# Altium schematic sheet Ubiwatch.SchDoc
size A; SheetNumber: 1; SheetTotal: 4
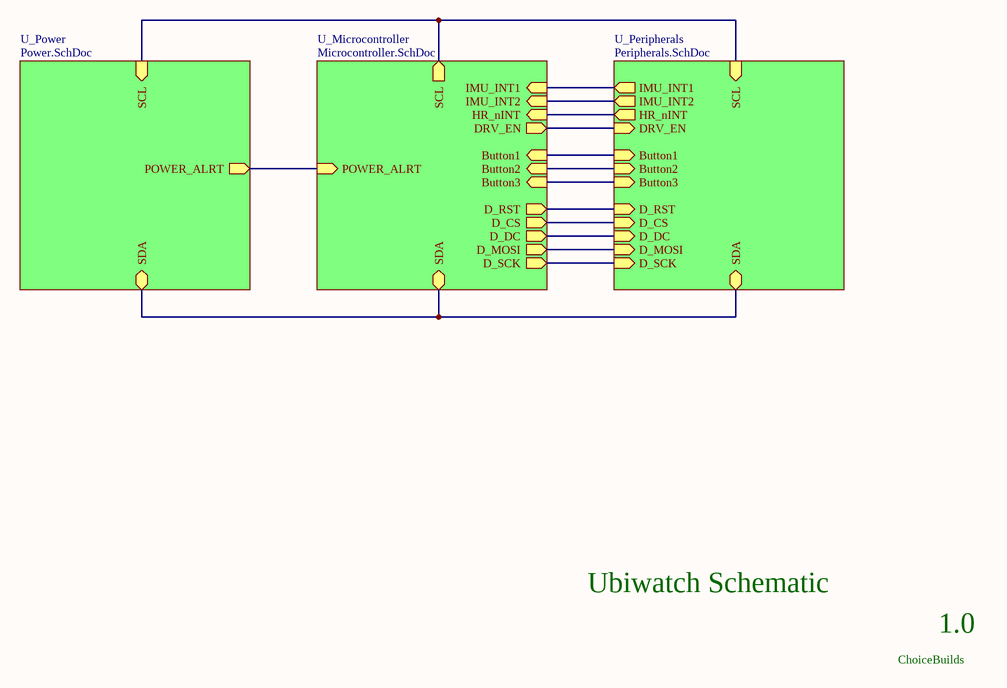
[diagram p0: Ubiwatch.SchDoc]

## Sub-sheets
U_Microcontroller = Microcontroller.SchDoc: DRV_EN (out), HR_nINT (in), POWER_ALRT (in), IMU_INT2 (in), IMU_INT1 (in), D_SCK (out), D_MOSI (out), D_DC (out), D_CS (out), Button3 (in), Button2 (in), Button1 (in), D_RST (out), SCL (out), SDA (bidir)
U_Peripherals = Peripherals.SchDoc: IMU_INT1 (out), IMU_INT2 (out), DRV_EN (in), HR_nINT (out), Button1 (in), Button2 (in), Button3 (in), D_RST (in), D_CS (in), D_DC (in), D_MOSI (in), D_SCK (in), SCL (in), SDA (bidir)
U_Power = Power.SchDoc: SCL (in), SDA (bidir), POWER_ALRT (out)

## Nets
(unnamed): sheet U_Microcontroller/DRV_EN, sheet U_Peripherals/DRV_EN
(unnamed): sheet U_Microcontroller/HR_nINT, sheet U_Peripherals/HR_nINT
(unnamed): sheet U_Microcontroller/POWER_ALRT, sheet U_Power/POWER_ALRT
(unnamed): sheet U_Microcontroller/IMU_INT2, sheet U_Peripherals/IMU_INT2
(unnamed): sheet U_Microcontroller/IMU_INT1, sheet U_Peripherals/IMU_INT1
(unnamed): sheet U_Microcontroller/D_SCK, sheet U_Peripherals/D_SCK
(unnamed): sheet U_Microcontroller/D_MOSI, sheet U_Peripherals/D_MOSI
(unnamed): sheet U_Microcontroller/D_DC, sheet U_Peripherals/D_DC
(unnamed): sheet U_Microcontroller/D_CS, sheet U_Peripherals/D_CS
(unnamed): sheet U_Microcontroller/Button3, sheet U_Peripherals/Button3
(unnamed): sheet U_Microcontroller/Button2, sheet U_Peripherals/Button2
(unnamed): sheet U_Microcontroller/Button1, sheet U_Peripherals/Button1
(unnamed): sheet U_Microcontroller/D_RST, sheet U_Peripherals/D_RST
(unnamed): sheet U_Microcontroller/SCL, sheet U_Power/SCL, sheet U_Peripherals/SCL
(unnamed): sheet U_Microcontroller/SDA, sheet U_Power/SDA, sheet U_Peripherals/SDA

## Notes on the sheet
- Ubiwatch Schematic
- 1.0
- ChoiceBuilds